# EAGLE design motor_controller (EAGLE 6.5.0)
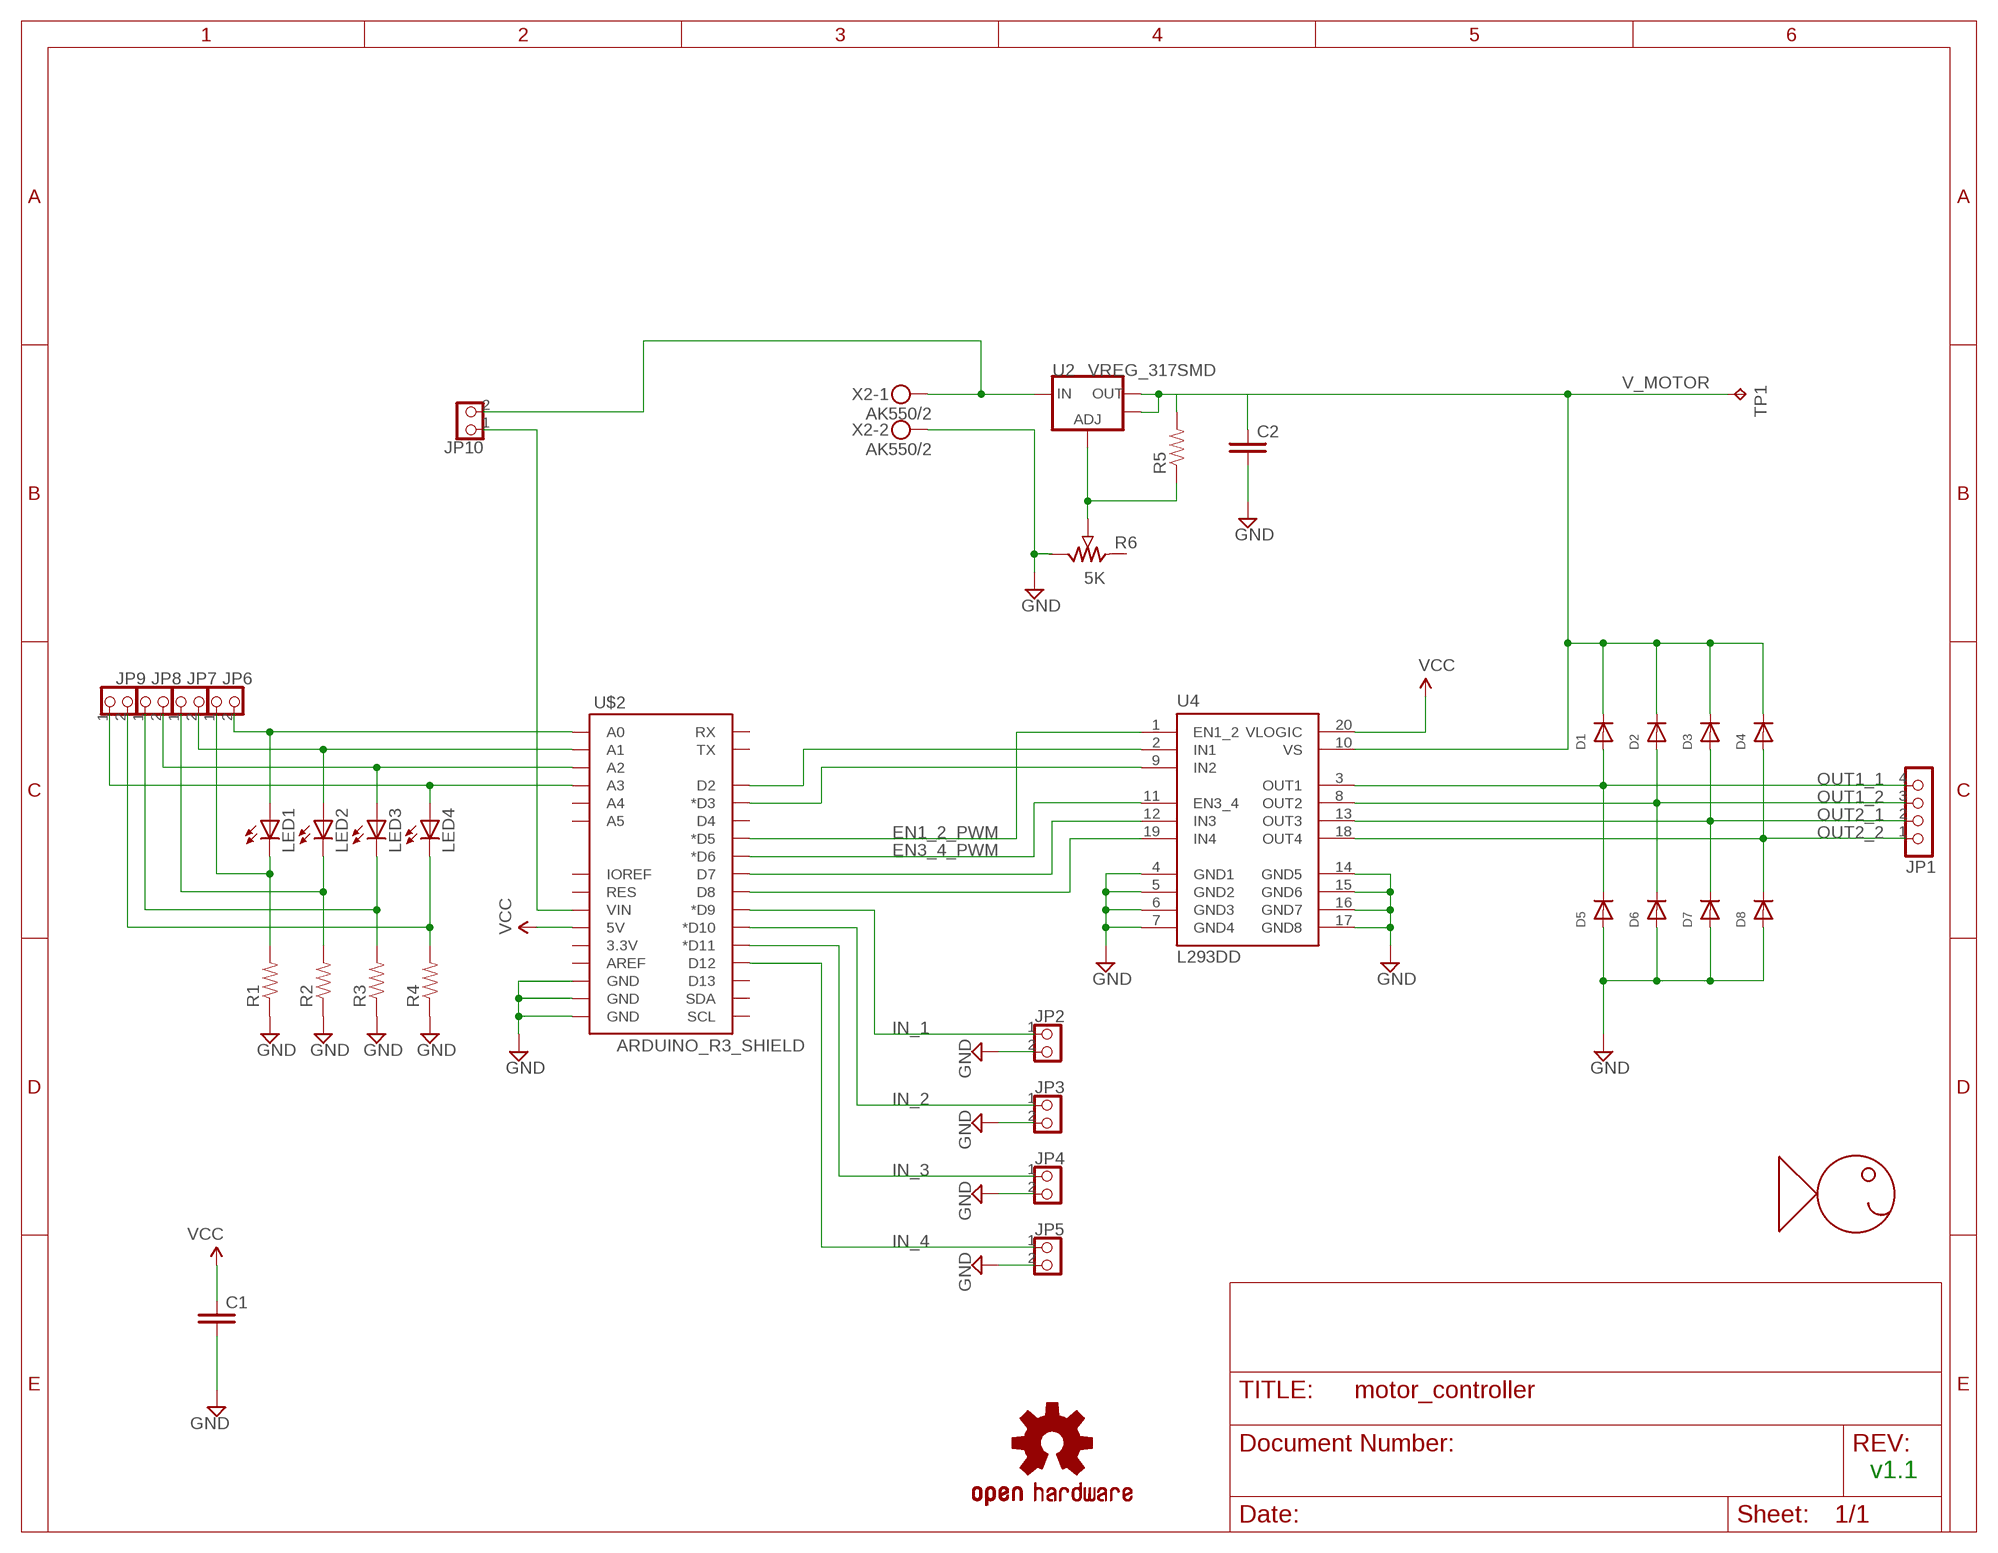
[diagram p0: schematic, sheet 1]

## Parts
C1  CAPACITORC0603  [C0603]
C2  CAPACITORC0603  [C0603]
D1  DIODESOD-123  [SOD-123]
D2  DIODESOD-123  [SOD-123]
D3  DIODESOD-123  [SOD-123]
D4  DIODESOD-123  [SOD-123]
D5  DIODESOD-123  [SOD-123]
D6  DIODESOD-123  [SOD-123]
D7  DIODESOD-123  [SOD-123]
D8  DIODESOD-123  [SOD-123]
JP1  PINHD-1X4/90  [1X04/90]
JP2  PINHD-1X2  [1X02]
JP3  PINHD-1X2  [1X02]
JP4  PINHD-1X2  [1X02]
JP5  PINHD-1X2  [1X02]
JP6  PINHD-1X2  [1X02]
JP7  PINHD-1X2  [1X02]
JP8  PINHD-1X2  [1X02]
JP9  PINHD-1X2  [1X02]
JP10  PINHD-1X2  [1X02]
LED1  LED0805  [LED_0805]
LED2  LED0805  [LED_0805]
LED3  LED0805  [LED_0805]
LED4  LED0805  [LED_0805]
LOGO1  OSHW-LOGOM  [OSHW-LOGO-M]
R1  RESISTOR_SMD0603-RES  [0603-RES]
R2  RESISTOR_SMD0603-RES  [0603-RES]
R3  RESISTOR_SMD0603-RES  [0603-RES]
R4  RESISTOR_SMD0603-RES  [0603-RES]
R5  RESISTOR_SMD0603-RES  [0603-RES]
R6  5K  POTBOURNS_3362H  [BOURNS_3362H]
TP1  TEST_POINTPAD1-20  [P1-20]
U2  VREG_317SMD  [SOT223]
U4  L293DD  [SO20]
U$1  FHI_LOGO  [FHI_LOGO]
U$2  ARDUINO_R3_SHIELD  [UNO_R3_SHIELD]
X2  AK550/2  [AK550/2]

## Nets
EN1_2_PWM: U4.1(EN1_2) U$2.D5(*D5)
EN3_4_PWM: U4.11(EN3_4) U$2.D6(*D6)
GND: C1.2 C2.2 D5.A D6.A D7.A D8.A JP2.2 JP3.2 JP4.2 JP5.2 R1.1 R2.1 R3.1 R4.1 R6.3 U4.4(GND1) U4.5(GND2) U4.6(GND3) U4.7(GND4) U4.14(GND5) U4.15(GND6) U4.16(GND7) U4.17(GND8) U$2.GND@0(GND) U$2.GND@1(GND) U$2.GND@2(GND) X2.2
IN1: U4.2(IN1) U$2.D2
IN2: U4.9(IN2) U$2.D3(*D3)
IN3: U4.12(IN3) U$2.D7
IN4: U4.19(IN4) U$2.D8
IN_1: JP2.1 U$2.D9(*D9)
IN_2: JP3.1 U$2.D10(*D10)
IN_3: JP4.1 U$2.D11(*D11)
IN_4: JP5.1 U$2.D12
N$1: JP10.1 U$2.VIN
N$2: JP6.2 LED1.A U$2.A0
N$3: JP7.2 LED2.A U$2.A1
N$4: JP8.2 LED3.A U$2.A2
N$5: JP9.1 LED4.A U$2.A3
N$9: JP10.2 U2.3(IN) X2.1
N$10: JP9.2 LED4.C R4.2
N$11: R5.1 R6.2 U2.1(ADJ)
N$12: JP8.1 LED3.C R3.2
N$13: JP7.1 LED2.C R2.2
N$14: JP6.1 LED1.C R1.2
OUT1_1: D1.A D5.C JP1.4 U4.3(OUT1)
OUT1_2: D2.A D6.C JP1.3 U4.8(OUT2)
OUT2_1: D3.A D7.C JP1.2 U4.13(OUT3)
OUT2_2: D4.A D8.C JP1.1 U4.18(OUT4)
V_MOTOR: C2.1 D1.C D2.C D3.C D4.C R5.2 TP1.TP U2.2(OUT1) U2.4(OUT2) U4.10(VS)
VCC: C1.1 U4.20(VLOGIC) U$2.5V
Unconnected: R6.1 U$2.3.3V U$2.A4 U$2.A5 U$2.AREF U$2.D4 U$2.D13 U$2.IOREF U$2.RES U$2.RX U$2.SCL U$2.SDA U$2.TX

## Notes on the sheet
- v1.1

## Library data of the parts
C1 C2 = CyberRailGuru:CAPACITOR: CAPACITOR, American symbol
D1-D8 = adafruit:DIODE: Diode SMADIODE - SMA Surface Mount Package 20V 1A Schottky Diode Digikey: 641-1014-6-ND DO-1N4148 - Through Hole Small Current Diode SOD-123 20V 1 A (.5mV Vf) Schottky Diode - Digikey: MBRX120TPMSCT-ND SOD-323 10V 570mA (.38mV Vf, 3ns) Schottky Diode - Digikey: ZLLS410CT-ND SOD-523 30V 30mA Schottky Diode (RB751S-40TE61) - Digikey: RB751S-40TE61CT-ND SOT23-R/W - SOT23 Package (R = Solder Paste/Reflow Ovens, W = Hand-Soldering) BAT54Film 40V 300mA - Digikey: 497-7162-1-ND
JP1 = CyberRailGuru:PINHD-1X4: PIN HEADER
JP2-JP10 = CyberRailGuru:PINHD-1X2: PIN HEADER
LED1-LED4 = CyberRailGuru:LED: LEDs Standard schematic elements and footprints for 5mm, 3mm, 1206, and 0603 sized LEDs. 5mm - Spark Fun Electronics SKU : COM-00529 (and others)
LOGO1 = SparkFun-Aesthetics:OSHW-LOGO: Open Source Hardware Logo This logo indicates the piece of hardware it is found on incorporates a OSHW license and/or adheres to the definition of open source hardware found here: http://freedomdefined.org/OSHW
R1-R5 = CyberRailGuru:RESISTOR_SMD: Resistor Basic schematic elements and footprints for 0603, 1206, and PTH resistors.
R6 = CyberRailGuru:POT
TP1 = CyberRailGuru:TEST_POINT: Test pad
U2 = CyberRailGuru:VREG_317: Voltage Regulator Standard LM317 adjustable voltage regulator. AOI (Adjust Output Input). Google 'LM317 Calculator' for easy to use app to get the two resistor values needed. 240/720 for 5V output. 240/390 for 3.3V output. Spark Fun Electronics SKU : COM-00527
U4 = CyberRailGuru:L293DD: PUSH-PULL 4 CHANNEL DRIVER
U$1 = CyberRailGuru:FHI_LOGO: Fishhead Industries Logo
U$2 = SparkFun-Boards:ARDUINO_R3_SHIELD: Shield form compatible with the Arduino Uno R3.
X2 = CyberRailGuru:AK550/2: PCB mount connector; 3.5mm pitch.

## Board
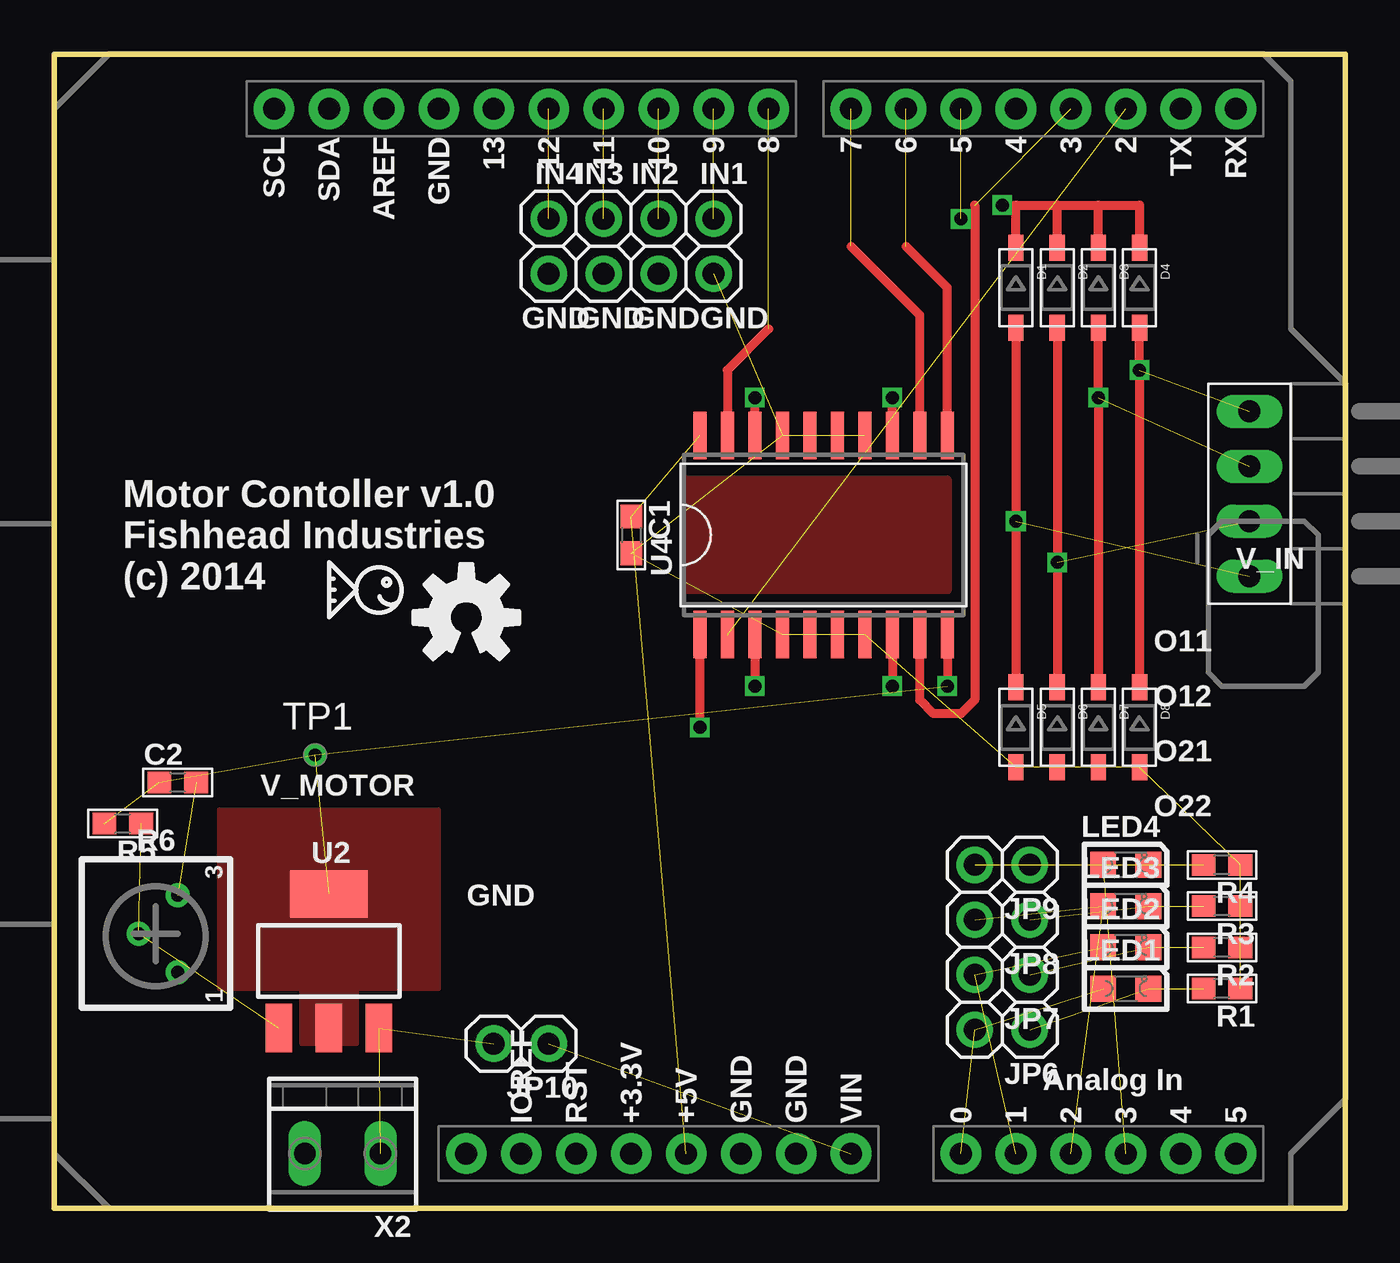
[diagram p1: board, top side]
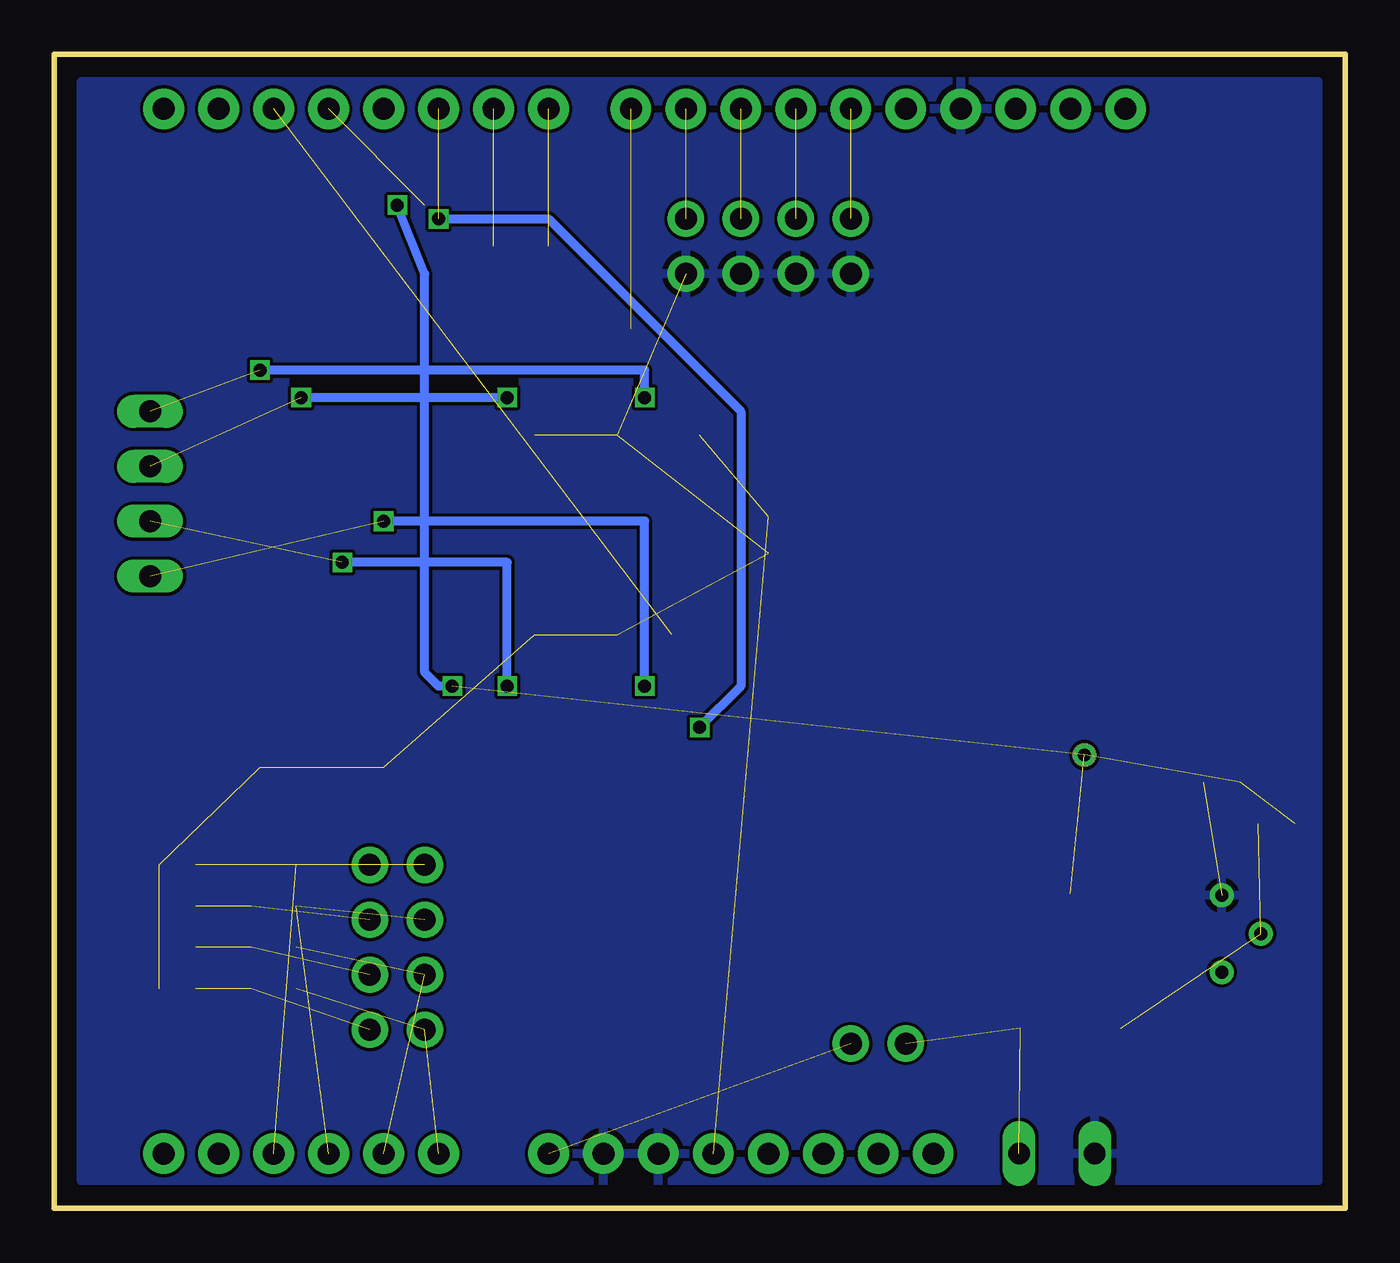
[diagram p2: board, bottom side, seen from below]

Size 59.68 x 53.33 mm. Coordinates in mm from the lower left corner, seen from the top.
Outline: 0,0 59.68,0 59.68,53.33 0,53.33 0,0
Copper layers (1*16): Top 0.035mm / dielectric 1.5mm / Bottom 0.035mm
Design rules "Fusion_eagle_rule_v1.1": minimum track width 6mil, minimum drill 12mil, track to track 6mil, track to pad 6mil, pad to pad 6mil, via to via 6mil, smd to smd 0mil, copper to edge 10mil, drill to drill 10mil, minimum pad ring 10mil, minimum via ring 6mil, stop-mask expansion 2mil, vias tented up to drill 100mil, thermal gap 10mil

### Footprints (pad centres in the part's own frame; a part is rotated, then mirrored left to right if it is on the bottom)
C0603 = smd 1.1 x 1: 1 -0.85,0; 2 0.85,0
SOD-123 = smd 1.2 x 0.7: A 1.85,0; C -1.85,0
1X04/90 = drill 1.016 long: 1 -3.81,0; 2 -1.27,0; 3 1.27,0; 4 3.81,0
1X02 = drill 1.016 pad 1.676: 1 -1.27,0; 2 1.27,0
LED_0805 = smd 1.2 x 1.2: A 0,-1.05; C 0,1.05
0603-RES = smd 1.1 x 1: 1 -0.85,0; 2 0.85,0
BOURNS_3362H = drill 0.6: 1 0,1.778; 2 1.803,0; 3 0,-1.778
P1-20 = drill 0.584: TP 0,0
SOT223 = smd 1.219 x 2.235: 1 -2.311,-3.099; 2 0,-3.099; 3 2.311,-3.099 | smd 3.6 x 2.2: 4 0,3.099
SO20 = smd 0.6 x 2.2: 1 -5.715,-4.6; 2 -4.445,-4.6; 3 -3.175,-4.6; 4 -1.905,-4.6; 5 -0.635,-4.6; 6 0.635,-4.6; 7 1.905,-4.6; 8 3.175,-4.6; 9 4.445,-4.6; 10 5.715,-4.6; 11 5.715,4.6; 12 4.445,4.6; 13 3.175,4.6; 14 1.905,4.6; 15 0.635,4.6; 16 -0.635,4.6; 17 -1.905,4.6; 18 -3.175,4.6; 19 -4.445,4.6; 20 -5.715,4.6
UNO_R3_SHIELD = drill 1.016 pad 1.88: 3.3V 50.8,26.67; 5V 50.8,29.21; A0 50.8,41.91; A1 50.8,44.45; A2 50.8,46.99; A3 50.8,49.53; A4 50.8,52.07; A5 50.8,54.61; AREF 2.54,15.24; D2 2.54,49.53; D3 2.54,46.99; D4 2.54,44.45; D5 2.54,41.91; D6 2.54,39.37; D7 2.54,36.83; D8 2.54,33.02; D9 2.54,30.48; D10 2.54,27.94; D11 2.54,25.4; D12 2.54,22.86; D13 2.54,20.32; GND@0 50.8,31.75; GND@1 50.8,34.29; GND@2 2.54,17.78; IOREF 50.8,21.59; NC 50.8,19.05; RES 50.8,24.13; RX 2.54,54.61; SCL 2.54,10.16; SDA 2.54,12.7; TX 2.54,52.07; VIN 50.8,36.83
AK550/2 = drill 1 pad 1.5 long: 1 -1.75,0; 2 1.75,0

### Placement (x,y rotation side)
C1  26.67,31.11 270 top
C2  5.71,19.68 0 top
D1  44.45,42.55 270 top
D2  46.35,42.55 270 top
D3  48.26,42.55 270 top
D4  50.16,42.55 270 top
D5  44.45,22.23 270 top
D6  46.35,22.23 270 top
D7  48.26,22.23 270 top
D8  50.16,22.23 270 top
JP1  55.24,33.02 270 top
JP2  30.48,44.45 270 top
JP3  27.94,44.45 270 top
JP4  25.4,44.45 270 top
JP5  22.86,44.45 270 top
JP6  43.81,8.26 180 top
JP7  43.81,10.79 180 top
JP8  43.81,13.34 180 top
JP9  43.81,15.88 180 top
JP10  21.59,7.62 180 top
LED1  49.53,10.16 270 top
LED2  49.53,12.06 270 top
LED3  49.53,13.97 270 top
LED4  49.53,15.88 270 top
LOGO1  19.05,27.3 0 top
R1  53.98,10.16 180 top
R2  53.98,12.06 180 top
R3  53.98,13.97 180 top
R4  53.98,15.88 180 top
R5  3.17,17.78 180 top
R6  5.71,12.7 180 top
TP1  12.06,20.95 0 top
U2  12.7,11.43 0 top
U4  35.56,31.11 0 top
U$1  13.97,28.57 0 top
U$2  0,53.34 270 top
X2  13.34,2.54 180 top

### Tracks (layer width: path | path; a pad name or v marks a point on that pad's centre or on a via)
EN1_2_PWM  (via drill 0.6)  (1 unrouted)
  Top 0.406: v29.84,22.23 U4.1
  Bottom 0.406: v41.91,45.72 36.83,45.72 27.94,36.83 27.94,24.13 v29.84,22.23
EN3_4_PWM  (1 unrouted)
  Top 0.406: U4.11 41.27,42.55 39.37,44.45
GND  (18 unrouted)
  pour Bottom: 1.27,52.07 1.27,1.27 58.42,1.27 58.42,52.07
  pour Top (no thermals): 41.27,33.66 41.27,28.57 29.21,28.57 29.21,33.66
IN1  (1 unrouted)
IN2  (1 unrouted)
  Top 0.406: 42.55,46.35 42.55,23.5 41.91,22.86 40.64,22.86 40.01,23.5 U4.9
IN3  (1 unrouted)
  Top 0.406: 36.83,44.45 40.01,41.27 U4.12
IN4  (1 unrouted)
  Top 0.406: 33.02,40.64 31.11,38.73 U4.19
IN_1  (1 unrouted)
IN_2  (1 unrouted)
IN_3  (1 unrouted)
IN_4  (1 unrouted)
N$1  (1 unrouted)
N$2  (2 unrouted)
N$3  (2 unrouted)
N$4  (2 unrouted)
N$5  (2 unrouted)
N$9  (2 unrouted)
N$10  (2 unrouted)
N$11  (2 unrouted)
N$12  (2 unrouted)
N$13  (2 unrouted)
N$14  (2 unrouted)
OUT1_1  (via drill 0.6)  (1 unrouted)
  Top 0.406: D1.A v44.45,31.75 D5.C | U4.3 v32.38,24.13
  Bottom 0.406: v32.38,24.13 32.38,31.75 v44.45,31.75
OUT1_2  (via drill 0.6)  (1 unrouted)
  Top 0.406: D2.A v46.35,29.84 D6.C | U4.8 v38.73,24.13
  Bottom 0.406: v38.73,24.13 38.73,29.84 v46.35,29.84
OUT2_1  (via drill 0.6)  (1 unrouted)
  Top 0.406: U4.13 v38.73,37.47 | D3.A v48.26,37.47 D7.C
  Bottom 0.406: v38.73,37.47 v48.26,37.47
OUT2_2  (via drill 0.6)  (1 unrouted)
  Top 0.406: U4.18 v32.38,37.47 | D4.A v50.16,38.73 D8.C
  Bottom 0.406: v32.38,37.47 32.38,38.73 v50.16,38.73
V_MOTOR  (via drill 0.6)  (4 unrouted)
  Top 0.406: U4.10 v41.27,24.13 | v43.81,46.35 44.45,46.35 | 44.45,46.35 46.35,46.35 | 46.35,46.35 48.26,46.35 | 48.26,46.35 50.16,46.35 D4.C | D3.C 48.26,46.35 | D2.C 46.35,46.35 | D1.C 44.45,46.35
  Bottom 0.406: v41.27,24.13 41.91,24.13 42.55,24.77 42.55,43.18 v43.81,46.35
  pour Top (no thermals): 11.43,7.62 11.43,10.16 7.62,10.16 7.62,18.41 17.78,18.41 17.78,10.16 13.97,10.16 13.97,7.62
VCC  (2 unrouted)

### Text on the board
tPlace: Motor Contoller v1.0 | Fishhead Industries | (c) 2014
tNames: IN4 | IN3 | IN2 | IN1 | GND | GND | GND | GND | V_IN | O11 | O12 | O21 | V_MOTOR | O22 | GND